# EAGLE design 3comando (EAGLE 6.5.0)
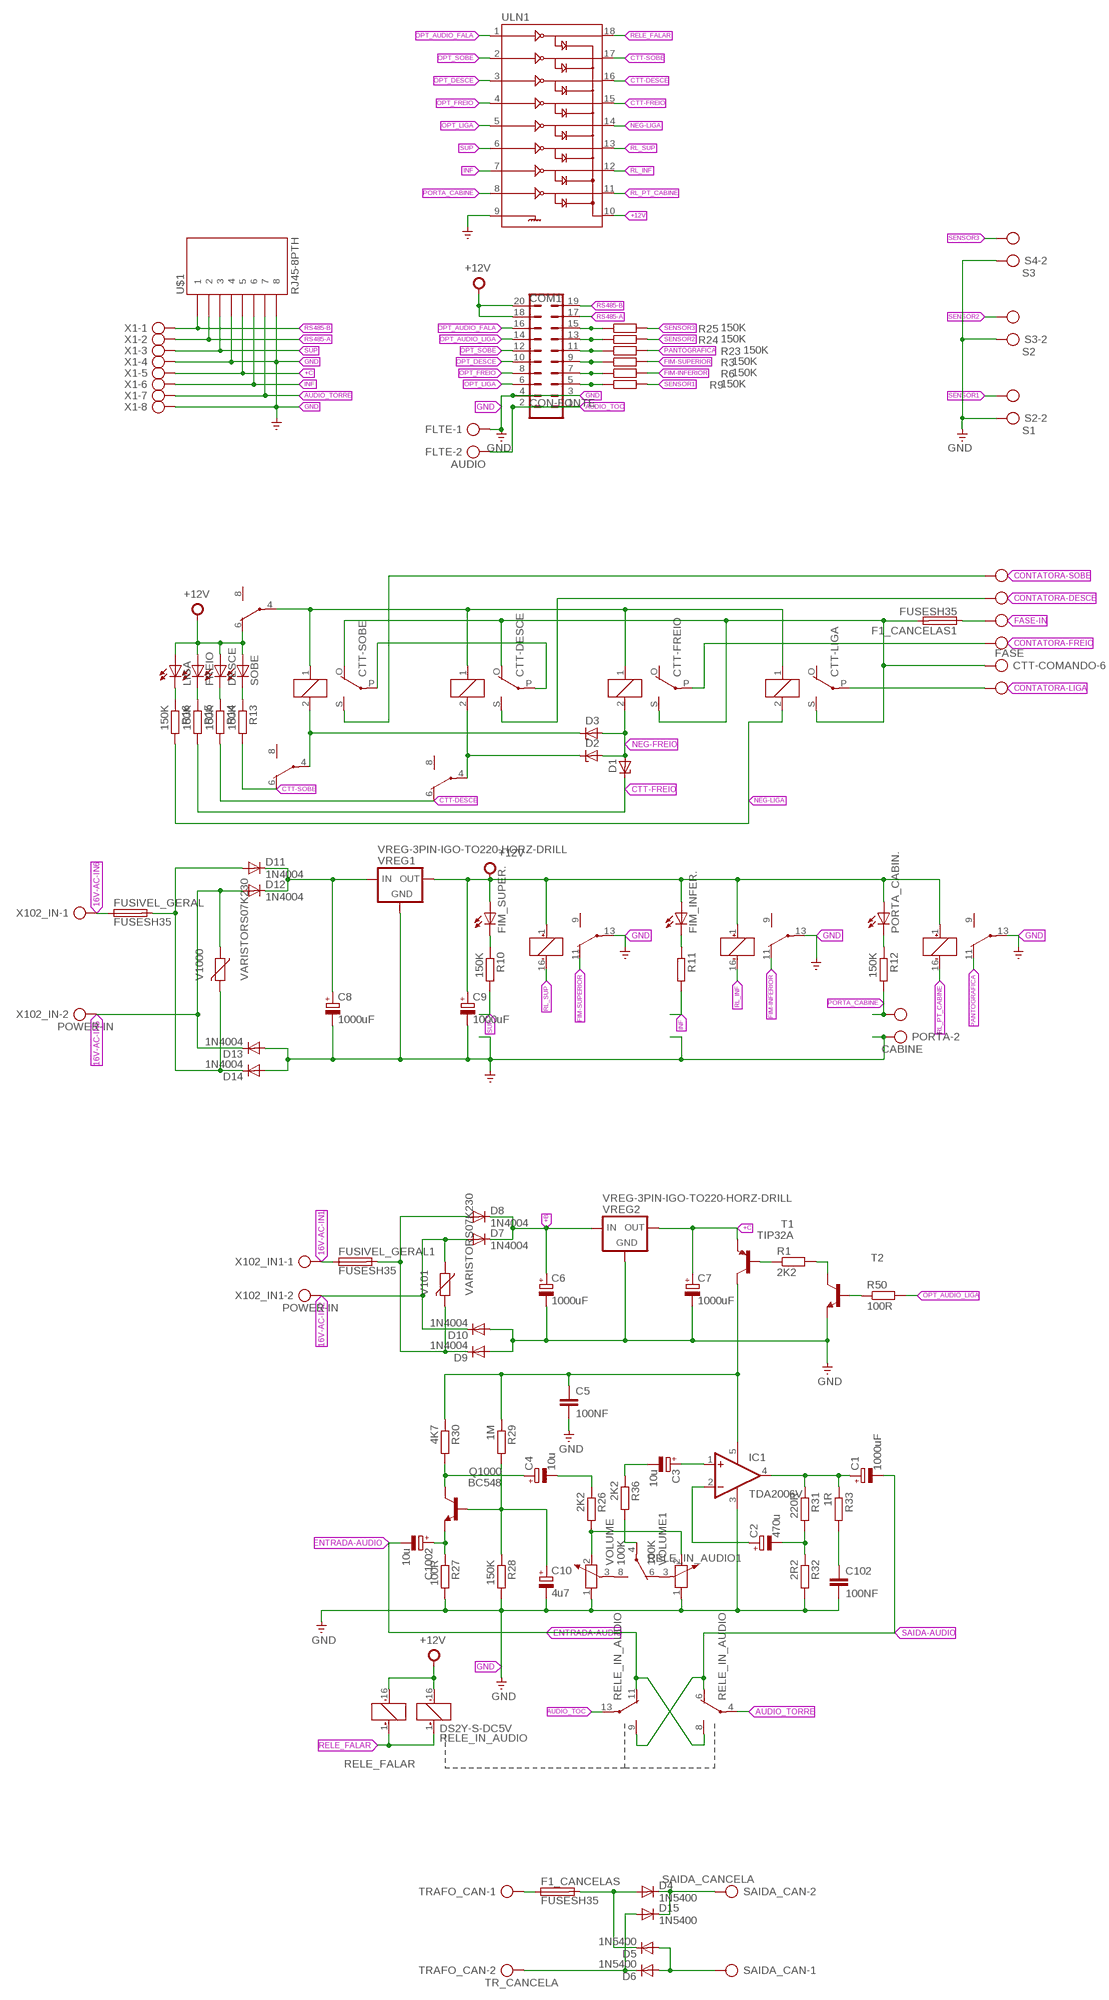
[diagram p0: schematic, sheet 1]

## Parts
C1  1000uF  CPOL-EUTAP5-80  [TAP5-80]
C2  470u  CPOL-EUTAP5-80  [TAP5-80]
C3  10u  CPOL-EUTAP5-45  [TAP5-45]
C4  10u  CPOL-EUTAP5-45  [TAP5-45]
C5  100NF  C-EU050-030X075  [C050-030X075]
C6  1000uF  CPOL-EUTAP5-80  [TAP5-80]
C7  1000uF  CPOL-EUTAP5-80  [TAP5-80]
C8  1000uF  CPOL-EUTAP5-80  [TAP5-80]
C9  1000uF  CPOL-EUTAP5-80  [TAP5-80]
C10  4u7  CPOL-EUTAP5-45  [TAP5-45]
C102  100NF  C-EU050-030X075  [C050-030X075]
C1002  10u  CPOL-EUTAP5-45  [TAP5-45]
COM1  CON-FONTE  ML20  [ML20]
CTT-COMANDO  FASE  AK500/6  [AK500/6]
CTT-DESCE  G5L  [G5LE]
CTT-FREIO  G5L  [G5LE]
CTT-LIGA  G5L  [G5LE]
CTT-SOBE  G5L  [G5LE]
D1  ZENER-DIODEZD-7.5  [ZDIO-7.5]
D2  ZENER-DIODEZD-7.5  [ZDIO-7.5]
D3  ZENER-DIODEZD-7.5  [ZDIO-7.5]
D4  1N5400  [DO201-15]
D5  1N5400  [DO201-15]
D6  1N5400  [DO201-15]
D7  1N4004  [DO41-10]
D8  1N4004  [DO41-10]
D9  1N4004  [DO41-10]
D10  1N4004  [DO41-10]
D11  1N4004  [DO41-10]
D12  1N4004  [DO41-10]
D13  1N4004  [DO41-10]
D14  1N4004  [DO41-10]
D15  1N5400  [DO201-15]
DESCE  LED5MM  [LED5MM]
F1_CANCELAS  FUSESH35  [SH25]
F1_CANCELAS1  FUSESH35  [SH25]
FIM_INFER.  LED5MM  [LED5MM]
FIM_SUPER.  LED5MM  [LED5MM]
FLTE  AUDIO  AK500/2  [AK500/2]
FREIO  LED5MM  [LED5MM]
FUSIVEL_GERAL  FUSESH35  [SH25]
FUSIVEL_GERAL1  FUSESH35  [SH25]
IC1  TDA2006V  [CB360]
LIGA  LED5MM  [LED5MM]
PORTA  CABINE  AK500/2  [AK500/2]
PORTA_CABIN.  LED5MM  [LED5MM]
PORTA_CABINE  DS2Y-S-DC5V  [DS2Y]
Q1000  BC548  [TO92-EBC]
R1  2K2  R-EU_0207/10  [0207/10]
R3  150K  R-EU_0207/10  [0207/10]
R6  150K  R-EU_0207/10  [0207/10]
R9  150K  R-EU_0207/10  [0207/10]
R10  150K  R-EU_0207/10  [0207/10]
R11  150K  R-EU_0207/10  [0207/10]
R12  150K  R-EU_0207/10  [0207/10]
R13  150K  R-EU_0207/10  [0207/10]
R14  150K  R-EU_0207/10  [0207/10]
R15  150K  R-EU_0207/10  [0207/10]
R16  150K  R-EU_0207/10  [0207/10]
R23  150K  R-EU_0207/10  [0207/10]
R24  150K  R-EU_0207/10  [0207/10]
R25  150K  R-EU_0207/10  [0207/10]
R26  2K2  R-EU_0207/10  [0207/10]
R27  100R  R-EU_0207/10  [0207/10]
R28  150K  R-EU_0207/10  [0207/10]
R29  1M  R-EU_0207/10  [0207/10]
R30  4K7  R-EU_0207/10  [0207/10]
R31  220R  R-EU_0207/10  [0207/10]
R32  2R2  R-EU_0207/10  [0207/10]
R33  1R  R-EU_0207/10  [0207/10]
R36  2K2  R-EU_0207/10  [0207/10]
R50  100R  R-EU_0207/10  [0207/10]
RELE_IN_AUDIO  DS2Y-S-DC5V  [DS2Y]
RELE_IN_AUDIO1  DS2Y-S-DC5V  [DS2Y]
RL_FIM_INFERIOR  DS2Y-S-DC5V  [DS2Y]
RL_FIM_SUPERIOR  DS2Y-S-DC5V  [DS2Y]
S2  S1  AK500/2  [AK500/2]
S3  S2  AK500/2  [AK500/2]
S4  S3  AK500/2  [AK500/2]
SAIDA_CAN  SAIDA_CANCELA  AK500/2  [AK500/2]
SOBE  LED5MM  [LED5MM]
T1  TIP32A  [TO220]
T2  BC548-NPN-TO92-CBE  [TO92-CBE]
TRAFO_CAN  TR_CANCELA  AK500/2  [AK500/2]
U$1  RJ45-8PTH  [RJ45-8]
ULN1  ULN2803DIP  [DIL18]
V101  VARISTORS07K230  [S07K230]
V1000  VARISTORS07K230  [S07K230]
VOLUME  100K  POTENTIOMETER_PT-10  [PT-10]
VOLUME1  100K  POTENTIOMETER_PT-10  [PT-10]
VREG1  VREG-3PIN-IGO-TO220-HORZ-DRILL  [TO220-HORZ-DRILL]
VREG2  VREG-3PIN-IGO-TO220-HORZ-DRILL  [TO220-HORZ-DRILL]
X1  RS485_CNT  AK500/8  [AK500/8]
X102_IN  POWER-IN  AK500/2  [AK500/2]
X102_IN1  POWER-IN  AK500/2  [AK500/2]

## Nets
16V-AC-IN1 [power]: FUSIVEL_GERAL1.1 X102_IN1.1
16V-AC-IN2 [power]: D7.A D10.C V101.1 X102_IN1.2
16V-AC-IN5 [power]: D12.A D13.C V1000.1 X102_IN.2
16V-AC-IN6 [power]: FUSIVEL_GERAL.1 X102_IN.1
+12V [power]: C9.+ COM1.18 COM1.20 DESCE.A FIM_INFER..A FIM_SUPER..A FREIO.A LIGA.A PORTA_CABIN..A PORTA_CABINE.1(1:+) PORTA_CABINE.6(2:O) RELE_IN_AUDIO1.16(1:-) RELE_IN_AUDIO.16(1:-) RL_FIM_INFERIOR.1(1:+) RL_FIM_SUPERIOR.1(1:+) SOBE.A ULN1.10 VREG1.3(OUT)
+B [power]: C6.+ D7.C D8.C VREG2.1(IN)
+C [power]: C7.+ T1.3(E) U$1.5 VREG2.3(OUT) X1.5
AC-ALIM [AC]: CTT-COMANDO.6 CTT-DESCE.O(2:O) CTT-FREIO.S(2:S) CTT-LIGA.S(2:S) CTT-SOBE.O(2:O) F1_CANCELAS1.2
AUDIO_TOC [power]: COM1.1 COM1.2 FLTE.2 RELE_IN_AUDIO.13(3:P)
AUDIO_TORRE [power]: RELE_IN_AUDIO.4(2:P) U$1.7 X1.7
CONTATORA-DESCE [AC]: CTT-COMANDO.4 CTT-DESCE.S(2:S)
CONTATORA-FREIO [AC]: CTT-COMANDO.3 CTT-FREIO.P(2:P)
CONTATORA-LIGA [AC]: CTT-COMANDO.2 CTT-LIGA.P(2:P)
CONTATORA-SOBE [AC]: CTT-COMANDO.5 CTT-SOBE.S(2:S)
CTT-DESCE: R14.2 RL_FIM_INFERIOR.6(2:O) ULN1.16
CTT-FREIO: D1.C R15.2 ULN1.15
CTT-SOBE: R13.2 RL_FIM_SUPERIOR.6(2:O) ULN1.17
ENTRADA-AUDIO: C1002.- RELE_IN_AUDIO.8(2:S) RELE_IN_AUDIO.11(3:O)
FASE-IN [AC]: CTT-COMANDO.1 F1_CANCELAS1.1
FIM-INFERIOR: R6.2 RL_FIM_INFERIOR.11(3:O)
FIM-SUPERIOR: R3.2 RL_FIM_SUPERIOR.11(3:O)
GND [power]: C5.2 C6.- C7.- C8.- C9.- C10.- C102.2 COM1.3 COM1.4 D9.A D10.A D13.A D14.A FLTE.1 IC1.3(V-) PORTA.2 PORTA_CABINE.13(3:P) R27.2 R28.2 R32.2 RL_FIM_INFERIOR.13(3:P) RL_FIM_SUPERIOR.13(3:P) S2.2 S3.2 S4.2 T2.E U$1.4 U$1.8 ULN1.9 VOLUME1.1 VOLUME.1 VREG1.2(GND) VREG2.2(GND) X1.4 X1.8
INF: R11.2 U$1.6 ULN1.7 X1.6
N$1 [AC]: D4.C D15.C SAIDA_CAN.2
N$2 [AC]: D4.A D5.C F1_CANCELAS.2
N$3 [AC]: D6.C D15.A TRAFO_CAN.2
N$4 [AC]: D5.A D6.A SAIDA_CAN.1
N$5 [power]: CTT-DESCE.1 CTT-FREIO.1 CTT-LIGA.1 CTT-SOBE.1 PORTA_CABINE.4(2:P)
N$6: RELE_IN_AUDIO1.8(2:S) VOLUME.3
N$7 [power]: C8.+ D11.C D12.C VREG1.1(IN)
N$10: FIM_SUPER..K(C) R10.1
N$11: R26.2 VOLUME1.2 VOLUME.2
N$19: FIM_INFER..K(C) R11.1
N$21: R1.1 T1.1(B)
N$24: PORTA_CABIN..K(C) R12.1
N$28: R13.1 SOBE.K(C)
N$29: DESCE.K(C) R14.1
N$32: FREIO.K(C) R15.1
N$33: LIGA.K(C) R16.1
N$39: R50.1 T2.B
N$43: RELE_IN_AUDIO1.6(2:O) VOLUME1.3
N$44: R36.2 RELE_IN_AUDIO1.4(2:P)
N$78 [AC]: F1_CANCELAS.1 TRAFO_CAN.1
N$79 [power]: C1.+ IC1.4(OUT) R31.1 R33.1
N$80: C4.- R26.1
N$89: C4.+ Q1000.C R30.2
N$90: C10.+ Q1000.B R28.1 R29.2
N$92: C1002.+ Q1000.E R27.1
N$94: C3.- R36.1
N$104 [power]: C5.1 IC1.5(V+) R29.1 R30.1 T1.2(C)
N$105: C3.+ IC1.1(+IN)
N$106 [power]: C2.- R31.2 R32.1
N$119 [power]: C2.+ IC1.2(-IN)
N$120: C102.1 R33.2
NEG-DESCE: CTT-DESCE.2 D2.C RL_FIM_INFERIOR.4(2:P)
NEG-FREIO: CTT-FREIO.2 D1.A D2.A D3.A
NEG-LIGA: CTT-LIGA.2 R16.2 ULN1.14
NEG-SOB: CTT-SOBE.2 D3.C RL_FIM_SUPERIOR.4(2:P)
OPT_AUDIO_FALA: COM1.16 ULN1.1
OPT_AUDIO_LIGA: COM1.14 R50.2
OPT_DESCE: COM1.10 ULN1.3
OPT_FIM_INFERIOR: COM1.7 R6.1
OPT_FIM_SUPERIOR: COM1.9 R3.1
OPT_FREIO: COM1.8 ULN1.4
OPT_LIGA: COM1.6 ULN1.5
OPT_PANTOGRAFICA: COM1.11 R23.1
OPT_SENSOR1: COM1.5 R9.1
OPT_SENSOR2: COM1.13 R24.1
OPT_SENSOR3: COM1.15 R25.1
OPT_SOBE: COM1.12 ULN1.2
PANTOGRAFICA: PORTA_CABINE.11(3:O) R23.2
PORTA_CABINE: PORTA.1 R12.2 ULN1.8
RELE_FALAR: RELE_IN_AUDIO1.1(1:+) RELE_IN_AUDIO.1(1:+) ULN1.18
RELE_LIGA_AUDIO: R1.2 T2.C
RL_INF: RL_FIM_INFERIOR.16(1:-) ULN1.12
RL_PT_CABINE: PORTA_CABINE.16(1:-) ULN1.11
RL_SUP: RL_FIM_SUPERIOR.16(1:-) ULN1.13
RS485-A: COM1.17 U$1.2 X1.2
RS485-B: COM1.19 U$1.1 X1.1
SAIDA-AUDIO [power]: C1.- RELE_IN_AUDIO.6(2:O) RELE_IN_AUDIO.9(3:S)
SAIDA_FUSIVEL [power]: D11.A D14.C FUSIVEL_GERAL.2 V1000.2
SAIDA_FUSIVEL1 [power]: D8.A D9.C FUSIVEL_GERAL1.2 V101.2
SENSOR1: R9.2 S2.1
SENSOR2: R24.2 S3.1
SENSOR3: R25.2 S4.1
SOB-DESC-PROT [AC]: CTT-DESCE.P(2:P) CTT-SOBE.P(2:P)
SUP: R10.2 U$1.3 ULN1.6 X1.3
Unconnected: CTT-FREIO.O(2:O) CTT-LIGA.O(2:O) PORTA_CABINE.8(2:S) PORTA_CABINE.9(3:S) RELE_IN_AUDIO1.9(3:S) RELE_IN_AUDIO1.11(3:O) RELE_IN_AUDIO1.13(3:P) RL_FIM_INFERIOR.8(2:S) RL_FIM_INFERIOR.9(3:S) RL_FIM_SUPERIOR.8(2:S) RL_FIM_SUPERIOR.9(3:S)

## Library data of the parts
C1-C4 C6-C10 C1002 = rcl:CPOL-EU: POLARIZED CAPACITOR, European symbol
C5 C102 = rcl:C-EU: CAPACITOR, European symbol
COM1 = con-ml:ML20: HARTING; OC_FARNELL: unknown; OC_NEWARK: unknown
CTT-COMANDO = con-ptr500:AK500/6: CONNECTOR; OC_FARNELL: unknown; OC_NEWARK: unknown
CTT-DESCE CTT-FREIO CTT-LIGA CTT-SOBE = relay:G5L: RELAY 1 x switch, 10 A/120 V AC, 8 A/30 V ADC, Omron; OC_FARNELL: unknown; OC_NEWARK: unknown
D1-D3 = diode:ZENER-DIODE: Z-Diode
D4-D6 D15 = diode:1N5400: DIODE standard rectifier, 3 A, 50 V (Motorola)
D7-D14 = diode:1N4004: DIODE general purpose rectifier, 1 A
DESCE FIM_INFER. FIM_SUPER. FREIO LIGA PORTA_CABIN. SOBE = led:LED: LED OSRAM: - CHIPLED LG R971, LG N971, LY N971, LG Q971, LY Q971, LO R971, LY R971 LH N974, LH R974 LS Q976, LO Q976, LY Q976 LO Q996 - Hyper CHIPLED LW Q18S LB Q993, LB Q99A, LB R99A - SideLED LS A670, LO A670, LY A670, LG A670, LP A670 LB A673, LV A673, LT A673, LW A673 LH A674 LY A675 LS A676, LA A676, LO A676, LY A676, LW A676 LS A679, LY A679, LG A679 - Hyper Micro SIDELED® LS Y876, LA Y876, LO Y876, LY Y876 LT Y87S - SmartLED LW L88C, LW L88S LB L89C, LB L89S, LG L890 LS L89K, LO L89K, LY L89K LS L896, LA L896, LO L896, LY L896 - TOPLED LS T670, LO T670, LY T670, LG T670, LP T670 LSG T670, LSP T670, LSY T670, LOP T670, LYG T670 LG T671, LOG T671, LSG T671 LB T673, LV T673, LT T673, LW T673 LH T674 LS T676, LA T676, LO T676, LY T676, LB T676, LH T676, LSB T676, LW T676 LB T67C, LV T67C, LT T67C, LS T67K, LO T67K, LY T67K, LW E67C LS E67B, LA E67B, LO E67B, LY E67B, LB E67C, LV E67C, LT E67C LW T67C LS T679, LY T679, LG T679 LS T770, LO T770, LY T770, LG T770, LP T770 LB T773, LV T773, LT T773, LW T773 LH T774 LS E675, LA E675, LY E675, LS T675 LS T776, LA T776, LO T776, LY T776, LB T776 LHGB T686 LT T68C, LB T68C - Hyper Mini TOPLED® LB M676 - Mini TOPLED Santana® LG M470 LS M47K, LO M47K, LY M47K Source: http://www.osram.convergy.de LUXEON: - LUMILED® LXK2-PW12-R00, LXK2-PW12-S00, LXK2-PW14-U00, LXK2-PW14-V00 LXK2-PM12-R00, LXK2-PM12-S00, LXK2-PM14-U00 LXK2-PE12-Q00, LXK2-PE12-R00, LXK2-PE12-S00, LXK2-PE14-T00, LXK2-PE14-U00 LXK2-PB12-K00, LXK2-PB12-L00, LXK2-PB12-M00, LXK2-PB14-N00, LXK2-PB14-P00, LXK2-PB14-Q00 LXK2-PR12-L00, LXK2-PR12-M00, LXK2-PR14-Q00, LXK2-PR14-R00 LXK2-PD12-Q00, LXK2-PD12-R00, LXK2-PD12-S00 LXK2-PH12-R00, LXK2-PH12-S00 LXK2-PL12-P00, LXK2-PL12-Q00, LXK2-PL12-R00 Source: www.luxeon.com KINGBRIGHT: KA-3528ASYC Source: www.kingbright.com
F1_CANCELAS F1_CANCELAS1 FUSIVEL_GERAL FUSIVEL_GERAL1 = fuse:FUSE: Fuse; OC_FARNELL: unknown; OC_NEWARK: unknown
FLTE PORTA S2-S4 SAIDA_CAN TRAFO_CAN X102_IN X102_IN1 = con-ptr500:AK500/2: CONNECTOR; OC_FARNELL: unknown; OC_NEWARK: unknown
IC1 = linear:TDA2006: AUDIO AMPLIFIER
PORTA_CABINE RELE_IN_AUDIO RELE_IN_AUDIO1 RL_FIM_INFERIOR RL_FIM_SUPERIOR = relay:DS2Y-S-DC*: MINIATURE RELAY NAiS Source: http://www.mew-europe.com/.. en_ds_61005_0023.pdf; MPN: DS2Y-S-DC5V; OC_FARNELL: unknown; OC_NEWARK: 13P3268
Q1000 = transistor-npn:BC548*: NPN Transistor
R1 R3 R6 R9-R16 R23-R33 R36 R50 = rcl:R-EU_: RESISTOR, European symbol
T1 = transistor:TIP32: PNP Transistor Medium Power Linear Switching Applications Source: http://onsemi.com
T2 = transistor:*-NPN-: NPN Transistror BF959 corrected 2008.03.06
U$1 = SparkFun-Connectors:RJ45-8: RJ45 Jack Simple RJ45, 8-pin connection - connector for common Cat5, Cat5e, and Cat6 Ethernet cables. Footprint not yet proven in production. Connector sku is PRT-00643; Breakout PCB sku is BOB-00716.
ULN1 = SparkFun:ULN2803: Darlington Driver ULN2803 Darlington array. 500mA max per channel, 8-channel package. Spark Fun Electronics SKU : COM-00312
V101 V1000 = varistor:VARISTOR: VARISTOR
VOLUME VOLUME1 = rcl:POTENTIOMETER_: Potentiometer
VREG1 VREG2 = tidyeagle:VREG-3PIN: Generic 3 Pin Voltage Regulator For voltage regulators such as the LM7805 and similar. Horizontal TO220 packages are available with and without drill holes for mounting. Important: Note the pin connection and check against your datasheet. Pin 1 is the left most pin when looking down from the top of the package, as shown in the diagram on the right hand side. IGO (e.g. LM7805) Pin 1 - Input Pin 2 - GND Pin 3 - Output GOI (e.g. LD1086V33) Pin 1 - GND Pin 2 - Output Pin 3 - Input
X1 = con-ptr500:AK500/8: CONNECTOR; OC_FARNELL: unknown; OC_NEWARK: unknown

## Net classes
0 default: drill 0.203 mm, clearance 0.203 mm
1 AC: width 2.032 mm, drill 0.203 mm, clearance 0.203 mm
2 power: width 0.762 mm, drill 0.203 mm, clearance 0.203 mm

## Board
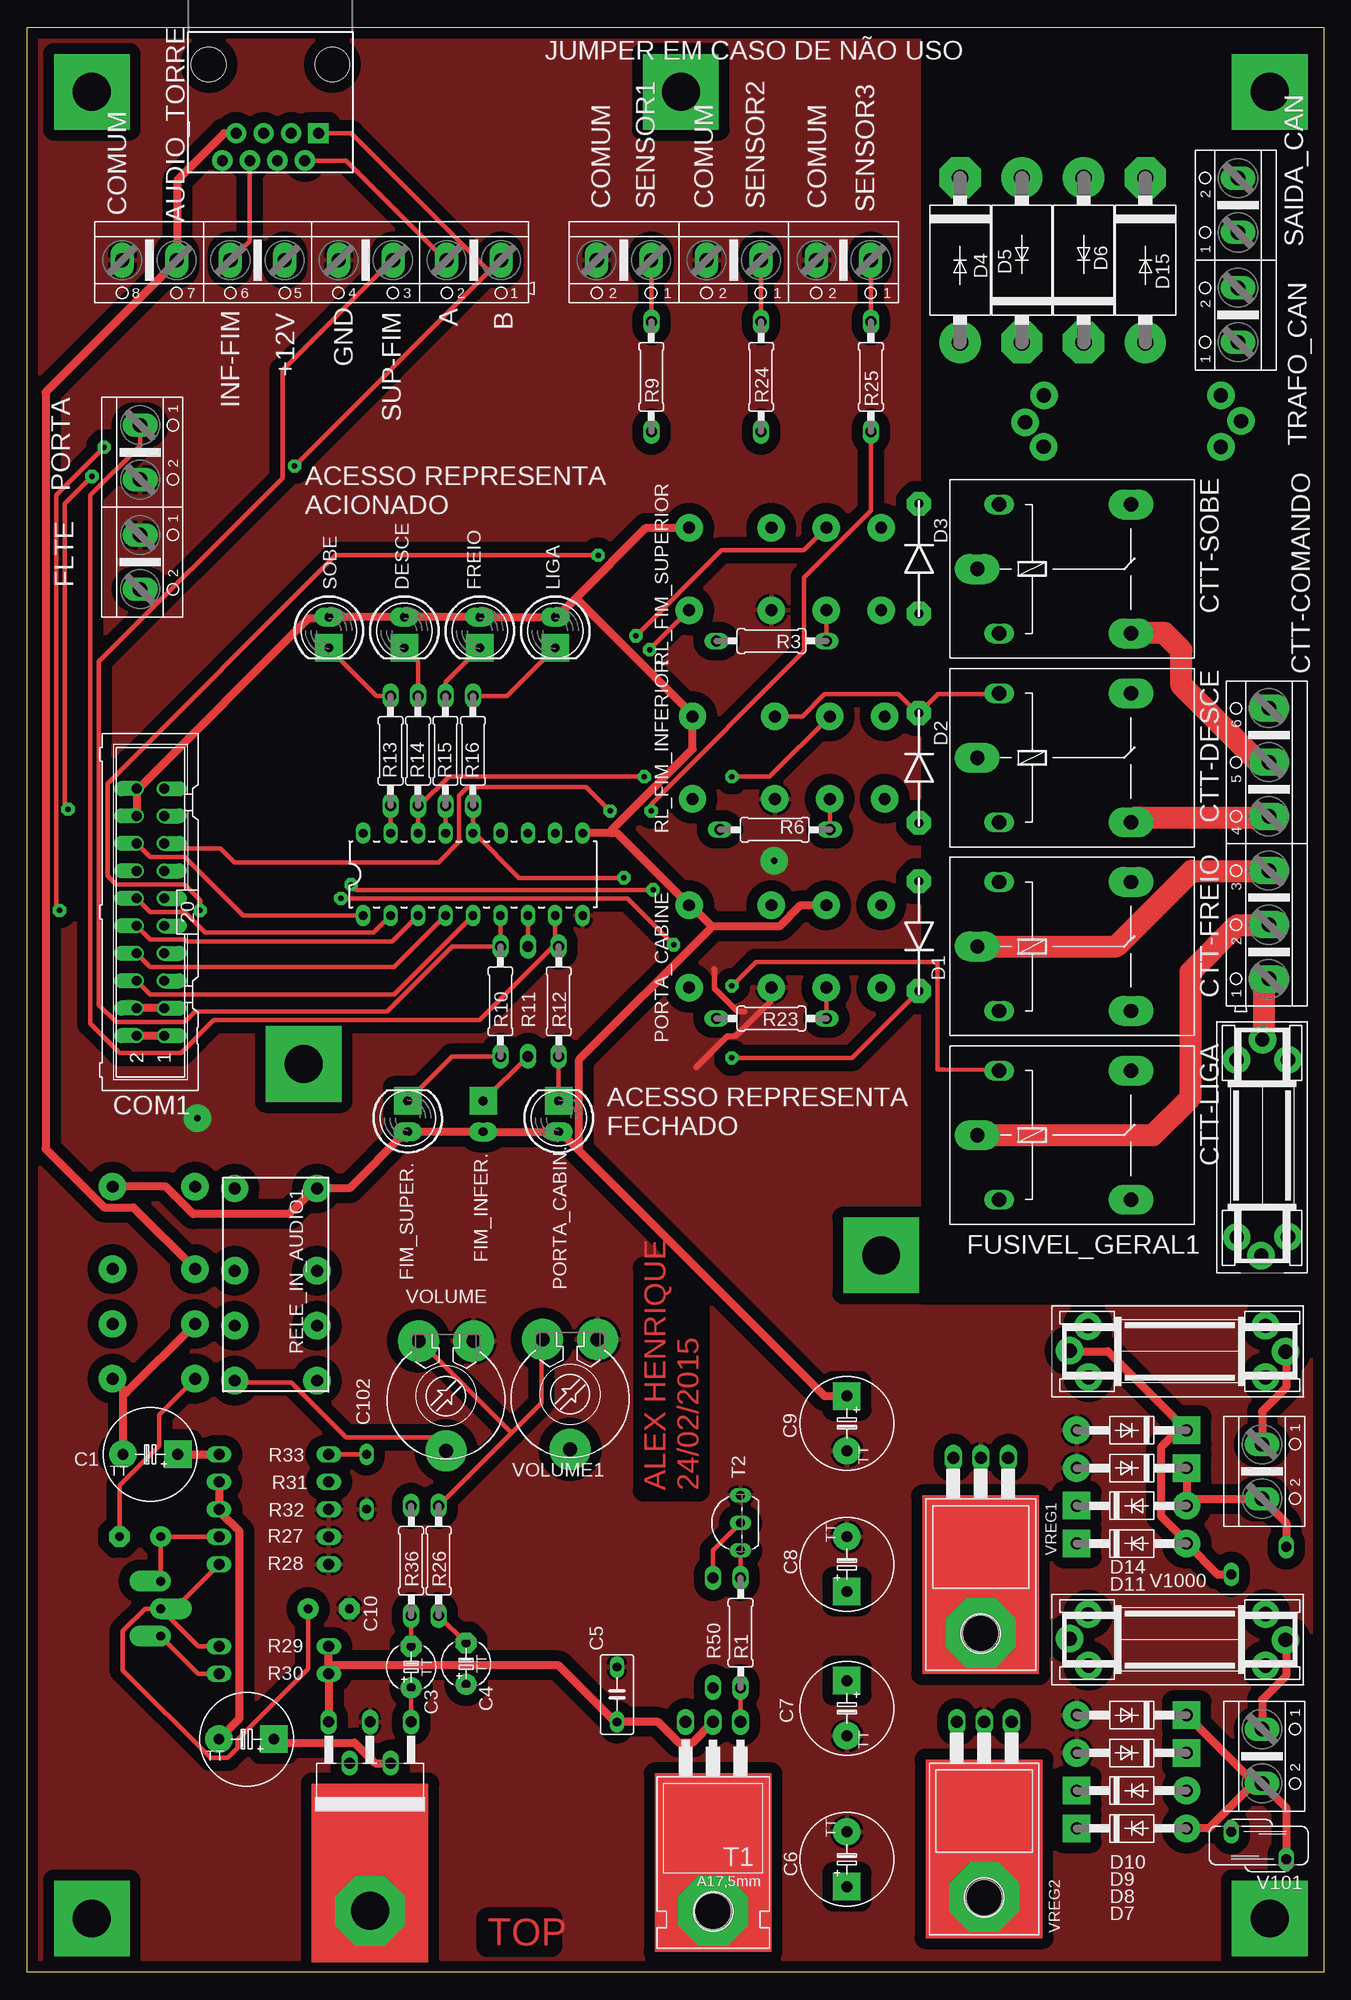
[diagram p1: board, top side]
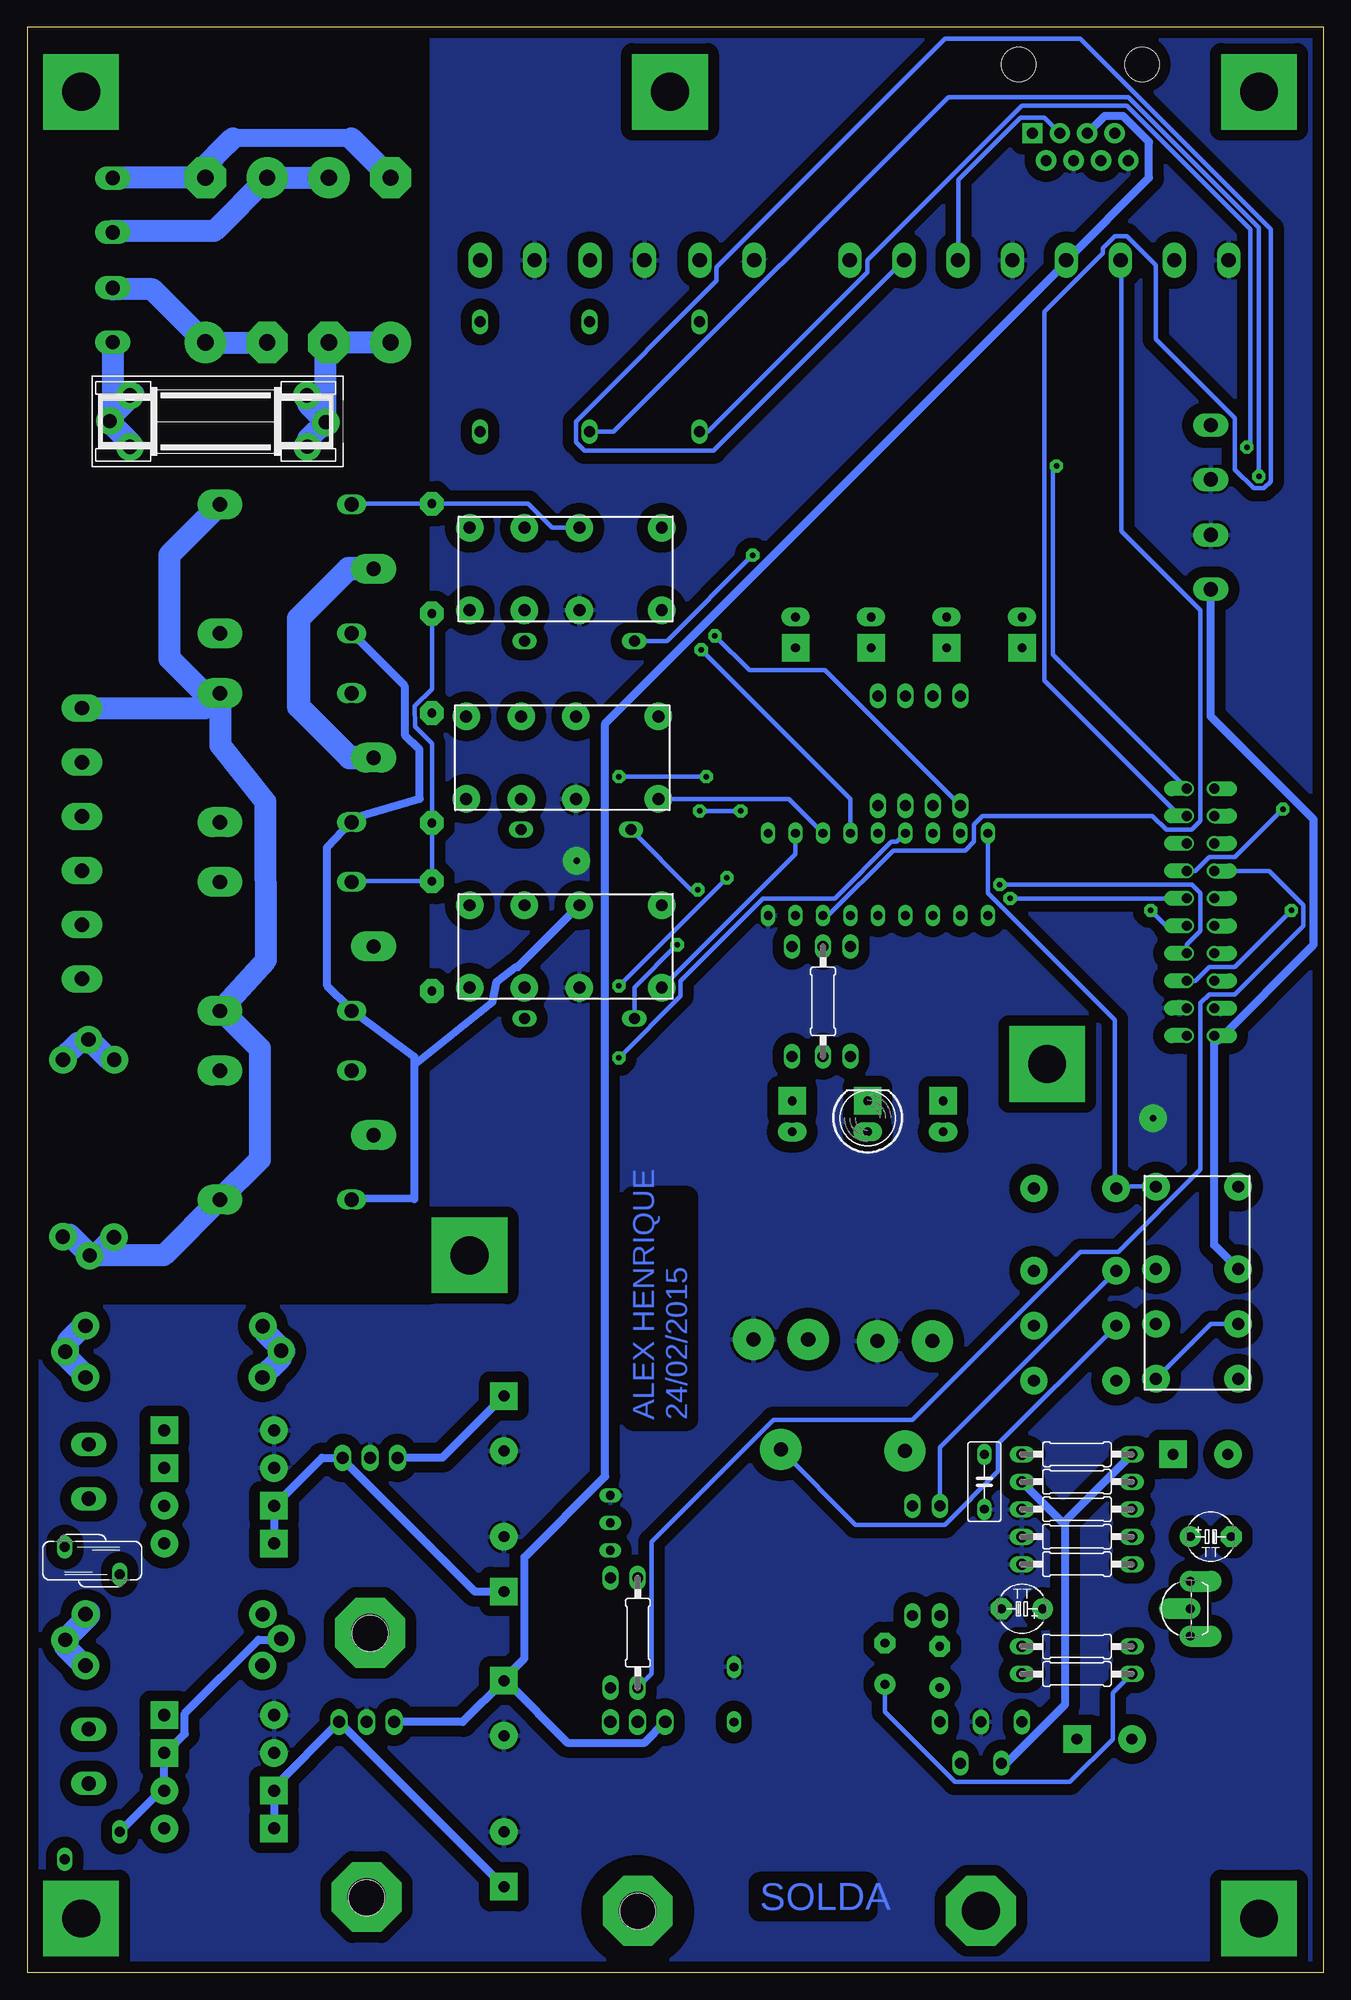
[diagram p2: board, bottom side, seen from below]

Size 120 x 180 mm. Coordinates in mm from the lower left corner, seen from the top.
Outline: 120,0 0,0 0,180 120,180 120,0
Copper layers (1*16): Top 0.035mm / dielectric 1.5mm / Bottom 0.035mm
Design rules "placa35": minimum track width 16mil, minimum drill 20mil, track to track 10mil, track to pad 10mil, pad to pad 10mil, via to via 10mil, smd to smd 10mil, copper to edge 20mil, drill to drill 10mil, minimum pad ring 10mil, minimum via ring 14mil, stop-mask expansion 4mil, vias tented up to drill 0mil, thermal gap 10mil

### Footprints (pad centres in the part's own frame; a part is rotated, then mirrored left to right if it is on the bottom)
TAP5-80 = drill 1 pad 2.54 square: + -2.54,0 | drill 1 pad 2.54: - 2.54,0
TAP5-45 = drill 0.813 pad 1.93: + -1.905,0 | drill 0.813 pad 1.93 octagon: - 1.905,0
C050-030X075 = drill 0.813 pad 1.27 long: 1 -2.54,0; 2 2.54,0
ML20 = drill 0.9 pad 1.016 offset: 1 -11.43,-1.27; 2 -11.43,1.27; 3 -8.89,-1.27; 4 -8.89,1.27; 5 -6.35,-1.27; 6 -6.35,1.27; 7 -3.81,-1.27; 8 -3.81,1.27; 9 -1.27,-1.27; 10 -1.27,1.27; 11 1.27,-1.27; 12 1.27,1.27; 13 3.81,-1.27; 14 3.81,1.27; 15 6.35,-1.27; 16 6.35,1.27; 17 8.89,-1.27; 18 8.89,1.27; 19 11.43,-1.27; 20 11.43,1.27
AK500/6 = drill 1.321 pad 2.54 long: 1 -12.522,0; 2 -7.518,0; 3 -2.515,0; 4 2.515,0; 5 7.518,0; 6 12.522,0
G5LE = drill 1.321 long: 1 -7.493,-5.969; 2 -7.493,5.969 | drill 1.321 pad 2.794 long: O 4.699,5.969; P -9.525,0; S 4.699,-5.969
ZDIO-7.5 = drill 0.813 pad 2.184 octagon: A 5.08,0; C -5.08,0
DO201-15 = drill 1.499 pad 3.81: A 7.62,0 | drill 1.499 pad 3.81 octagon: C -7.62,0
DO41-10 = drill 1.118 pad 2.54: A 5.08,0 | drill 1.118 pad 2.54 square: C -5.08,0
LED5MM = drill 0.813 pad 1.778 long: A -1.27,0 | drill 0.813 pad 2.54 square: K 1.587,0
SH25 = drill 1.321 pad 2.54: 1 -9.802,0.028; 2 10.18,-0.077; 4 -7.938,2.4; 5 -7.938,-2.362; 6 8.435,2.402; 7 8.475,-2.34
AK500/2 = drill 1.321 pad 2.184 long: 1 -2.515,0; 2 2.515,0
CB360 = drill 1.016 long: 1 -3.81,-8.255; 2 -1.905,-4.445; 3 0,-8.255; 4 1.905,-4.445; 5 3.81,-8.255
DS2Y = drill 1.1 pad 2.54: 1 -8.89,-3.81; 4 -1.27,-3.81; 6 3.81,-3.81; 8 8.89,-3.81; 9 8.89,3.81; 11 3.81,3.81; 13 -1.27,3.81; 16 -8.89,3.81
TO92-EBC = drill 0.813 pad 1.93 offset: B 0,-1.27; C -2.54,-1.27; E 2.54,-1.27
0207/10 = drill 1.016 pad 1.422 long: 1 -5.08,0; 2 5.08,0
TO220 = drill 1.118 long: 1 -2.54,-6.35; 2 0,-6.35; 3 2.54,-6.35 | hole 3.302: 0,11.176
TO92-CBE = drill 0.813 long: B 0,0; C -2.54,0; E 2.54,0
RJ45-8 = drill 1 pad 1.88 square: 1 -4.445,6.35 | drill 1 pad 1.88: 2 -3.175,8.89; 3 -1.905,6.35; 4 -0.635,8.89; 5 0.635,6.35; 6 1.905,8.89; 7 3.175,6.35; 8 4.445,8.89 | hole 3.2: -5.715,0; 5.715,0
DIL18 = drill 0.813 long: 1 -10.16,-3.81; 2 -7.62,-3.81; 3 -5.08,-3.81; 4 -2.54,-3.81; 5 0,-3.81; 6 2.54,-3.81; 7 5.08,-3.81; 8 7.62,-3.81; 9 10.16,-3.81; 10 10.16,3.81; 11 7.62,3.81; 12 5.08,3.81; 13 2.54,3.81; 14 0,3.81; 15 -2.54,3.81; 16 -5.08,3.81; 17 -7.62,3.81; 18 -10.16,3.81
S07K230 = drill 0.914 long: 1 -1.27,-2.54; 2 1.27,2.54
PT-10 = drill 1.3 pad 3.81: 1 -2.54,-5.08; 2 2.54,-5.08; 3 0,5.08
TO220-HORZ-DRILL = drill 1.118 long: 1 -2.54,-8.89; 2 0,-8.89; 3 2.54,-8.89 | hole 3.302: 0,7.366
AK500/8 = drill 1.321 pad 2.184 long: 1 -17.526,0; 2 -12.497,0; 3 -7.518,0; 4 -2.489,0; 5 2.489,0; 6 7.518,0; 7 12.497,0; 8 17.526,0

### Placement (x,y rotation side)
C1  11.42,47.94 180 top
C2  20.3,21.59 180 top
C3  35.54,28.26 90 top
C4  40.62,28.58 90 top
C5  54.59,25.72 90 top
C6  75.87,10.48 90 top
C7  75.87,24.45 270 top
C8  75.87,37.78 90 top
C9  75.87,50.8 270 top
C10  27.93,33.66 180 bottom
C102  31.42,45.4 270 bottom
C1002  10.46,40.32 0 bottom
COM1  11.42,98.11 90 top
CTT-COMANDO  114.92,104.46 90 top
CTT-DESCE  97.46,112.4 0 top
CTT-FREIO  97.46,94.93 0 top
CTT-LIGA  97.46,77.47 0 top
CTT-SOBE  97.46,129.86 0 top
D1  82.54,95.89 90 top
D2  82.54,111.44 270 top
D3  82.54,130.81 270 top
D4  86.34,158.43 270 top
D5  92.06,158.43 90 top
D6  97.78,158.43 90 top
D7  102.22,13.33 0 top
D8  102.22,16.83 0 top
D9  102.22,20.32 180 top
D10  102.22,23.81 180 top
D11  102.22,39.69 0 top
D12  102.22,43.18 0 top
D13  102.22,46.67 180 top
D14  102.22,50.16 180 top
D15  103.49,158.43 270 top
DESCE  34.91,124.14 270 top
F1_CANCELAS  102.54,143.51 0 bottom
F1_CANCELAS1  114.29,76.52 270 top
FIM_INFER.  42.21,79.06 90 bottom
FIM_SUPER.  35.23,79.06 90 top
FLTE  10.46,130.49 270 top
FREIO  41.89,124.14 270 top
FUSIVEL_GERAL  106.67,57.47 180 top
FUSIVEL_GERAL1  106.67,30.8 180 top
IC1  31.73,14.92 180 top
LIGA  48.88,124.14 270 top
PORTA  10.46,140.65 270 top
PORTA_CABIN.  49.2,79.06 90 top
PORTA_CABINE  70.15,94.93 180 bottom
Q1000  13.64,33.66 90 bottom
R1  66.03,31.43 90 top
R3  68.88,123.19 0 top
R6  69.2,105.73 0 top
R9  57.77,147.64 90 top
R10  43.8,89.85 90 top
R11  46.34,89.85 90 bottom
R12  49.2,89.85 90 top
R13  33.64,113.03 270 top
R14  36.18,113.03 270 top
R15  38.72,113.03 270 top
R16  41.26,113.03 270 top
R23  68.88,88.27 0 top
R24  67.93,147.64 90 top
R25  78.09,147.64 90 top
R26  38.08,38.1 90 top
R27  22.84,40.32 180 bottom
R28  22.84,37.78 180 bottom
R29  22.84,30.16 0 bottom
R30  22.84,27.62 0 bottom
R31  22.84,45.4 0 bottom
R32  22.84,42.86 180 bottom
R33  22.84,47.94 180 bottom
R36  35.54,38.1 90 top
R50  63.48,31.43 270 bottom
RELE_IN_AUDIO  11.73,63.82 270 bottom
RELE_IN_AUDIO1  23.02,63.65 270 top
RL_FIM_INFERIOR  70.47,112.4 180 bottom
RL_FIM_SUPERIOR  70.15,129.86 180 bottom
S2  55.23,158.43 180 top
S3  65.39,158.43 180 top
S4  75.55,158.43 180 top
SAIDA_CAN  112.06,163.51 90 top
SOBE  27.93,124.14 270 top
T1  63.48,16.83 180 top
T2  66.03,41.59 90 top
TRAFO_CAN  112.06,153.35 90 top
U$1  22.53,176.53 180 top
ULN1  41.26,101.6 0 top
V101  113.97,11.75 90 top
V1000  113.97,38.1 270 bottom
VOLUME  38.77,53.34 180 top
VOLUME1  50.25,53.49 180 top
VREG1  88.25,38.73 180 top
VREG2  88.57,14.29 180 top
X1  26.34,158.43 180 top
X102_IN  114.29,46.35 270 top
X102_IN1  114.29,20 270 top

### Tracks (layer width: path | path; a pad name or v marks a point on that pad's centre or on a via)
16V-AC-IN1
  Top 0.762: X102_IN1.1 114.29,25.24 116.51,27.46 116.51,30.64 FUSIVEL_GERAL1.1
16V-AC-IN2
  Top 0.762: V101.1 116.51,15.24 114.29,17.46 X102_IN1.2 | D7.A 109.36,13.34 113.33,17.3 113.97,17.3 X102_IN1.2 | D10.C 113.49,17.62 X102_IN1.2
16V-AC-IN5
  Top 0.762: V1000.1 116.51,41.59 114.29,43.82 X102_IN.2 113.97,43.82 107.62,43.82 D12.A D13.C
16V-AC-IN6
  Top 0.762: X102_IN.1 114.29,51.91 116.51,54.13 116.51,57.31 FUSIVEL_GERAL.1
+12V
  Top 0.762: 54.12,105.41 54.6,105.41 PORTA_CABINE.1 61.58,98.58 63.33,96.84 | 54.12,105.41 ULN1.10 | PORTA_CABINE.6 71.58,98.74 69.68,96.84 63.33,96.84 | 54.12,105.41 54.12,105.73 61.58,113.19 RL_FIM_INFERIOR.1 61.42,116.52 50.79,127.16 | COM1.18 COM1.20 10.46,109.7 26.02,125.25 27.61,125.25 SOBE.A DESCE.A FREIO.A LIGA.A 49.2,125.57 50.79,127.16 | RL_FIM_SUPERIOR.1 57.29,133.67 50.79,127.16 | RELE_IN_AUDIO.16 12.84,72.71 15.38,70.17 24.27,70.17 26.5,72.39 RELE_IN_AUDIO1.16 26.97,72.55 29.83,72.55 34.91,77.63 FIM_SUPER..A FIM_INFER..A PORTA_CABIN..A 49.52,77.63 50.86,76.28 | C9.+ 73.8,53.34 50.86,76.28 | 63.33,96.84 63.17,96.52 51.1,84.46 51.1,76.52 50.86,76.28
  Bottom 0.762: VREG1.3 81.58,47.63 C9.+
+B
  Bottom 0.762: D7.C D8.C 97.14,17.15 VREG2.1 C6.+
+C
  Bottom 0.762: U$1.5 20.31,171.77 18.56,171.77 16.18,169.39 16.18,166.05 23.8,158.43 X1.5 23.96,158.12 66.5,115.57 66.5,45.88 73.96,38.42 73.96,29.05 75.71,27.31 C7.+ | VREG2.3 79.68,23.18 C7.+ | T1.3 62.85,21.27 69.99,21.27 75.55,26.83 C7.+
AC-ALIM
  Top 2.032: 114.13,66.2 F1_CANCELAS1.2
  Bottom 2.032: CTT-DESCE.O 102.06,118.27 102.09,113.53 97.94,108.31 97.89,93.69 CTT-FREIO.S 101.93,88.96 98.46,85.5 98.46,75.2 CTT-LIGA.S 102.22,71.5 107.38,66.34 F1_CANCELAS1.2 | CTT-COMANDO.6 103.54,116.98 CTT-DESCE.O | CTT-DESCE.O 103.62,118.36 106.82,121.56 106.82,131.17 CTT-SOBE.O
AUDIO_TOC
  Top 0.762: COM1.2 COM1.1
  Bottom 0.762: RELE_IN_AUDIO.13 10.15,67.31 COM1.2 9.83,86.2 0.94,95.09 0.94,106.68 10.46,116.21 FLTE.2
AUDIO_TORRE
  Top 0.762: U$1.7 18.24,170.18 13.96,165.89 13.96,158.43 X1.7 13.64,158.12 1.73,146.21 1.73,76.2 7.13,70.8 9.83,70.8 RELE_IN_AUDIO.4
CONTATORA-DESCE
  Top 2.032: CTT-COMANDO.4 114.92,106.84 102.54,106.84 102.22,106.52 CTT-DESCE.S
CONTATORA-FREIO
  Top 2.032: CTT-FREIO.P 100.79,94.93 107.78,101.92 114.92,101.92 CTT-COMANDO.3
CONTATORA-LIGA
  Top 2.032: CTT-LIGA.P 104.18,77.47 107.68,80.98 107.68,92.58 112,96.9 114.88,96.9 CTT-COMANDO.2
CONTATORA-SOBE
  Top 2.032: CTT-COMANDO.5 113.94,111.98 106.82,119.1 106.82,122.35 105.24,123.93 102.19,123.93 CTT-SOBE.S
CTT-DESCE  (via drill 0.51)
  Top 0.406: ULN1.16 R14.2 36.34,107.95 39.04,110.65 v57.14,110.65 | v65.23,110.65 68.72,110.65 RL_FIM_INFERIOR.6
  Bottom 0.406: v65.23,110.65 v57.14,110.65
CTT-FREIO  (via drill 0.51)
  Top 0.406: R15.2 ULN1.15 | v65.23,84.61 76.34,84.61 D1.C
  Bottom 0.406: ULN1.15 39.51,104.62 39.99,104.62 45.23,99.38 51.9,99.38 59.52,91.76 59.52,90.33 v65.23,84.61
CTT-SOBE  (via drill 0.51)
  Top 0.406: R13.2 ULN1.17 | v56.34,123.67 64.28,131.6 71.9,131.6 RL_FIM_SUPERIOR.6
  Bottom 0.406: R13.2 46.18,120.49 53.17,120.49 v56.34,123.67
ENTRADA-AUDIO
  Top 0.406: C1002.- 8.56,45.09 12.21,48.74 12.21,51.59 RELE_IN_AUDIO.8
  Bottom 0.406: RELE_IN_AUDIO.11 10.46,60.01 RELE_IN_AUDIO.8
FASE-IN
  Top 2.032: F1_CANCELAS1.1 114.44,86.36 114.44,91.44 114.92,91.92 CTT-COMANDO.1
FIM-INFERIOR
  Top 0.406: RL_FIM_INFERIOR.11 R6.2
FIM-SUPERIOR
  Top 0.406: RL_FIM_SUPERIOR.11 R3.2
GND  (via drill 0.6 pad 2.54)
  Top 0.508: 68.84,91.19 68.84,89.89 65.62,86.66 64.81,86.66 61.88,83.74 | 66.38,88.9 65.75,88.9 63.61,91.03 63.61,92.84 63.59,92.86
  Top 0.762: COM1.3 COM1.4
  other vias: 69.15,102.87 69.15,102.87 15.78,79.02
  pour Top (isolate 1.016): -0.01,0 -0.01,180.02 82.54,180.02 82.54,61.59 120,61.59 120,0
  pour Bottom (isolate 1.016): -0.01,0 -0.01,180.02 82.54,180.02 82.54,61.59 120,61.59 120,0
INF
  Top 0.406: R11.2 ULN1.7 | U$1.6 20.62,160.18 18.88,158.43 X1.6
  Bottom 0.406: ULN1.7 45.86,97.79 39.83,103.82 33.16,103.82 32.37,104.62 32.37,106.2 31.58,107 15.86,107 14.59,105.73 12.21,105.73 11.42,106.52 11.42,126.05 18.72,133.35 18.72,158.43 X1.6
N$1
  Bottom 1.676: 90,169.7 100.95,169.7 arc-90 101.42,169.23
  Bottom 2.032: SAIDA_CAN.2 112.06,166.05 D15.C 103.65,167.01 101.42,169.23 100.95,169.7 | 90,169.7 D4.C
N$2
  Bottom 2.032: D4.A D5.C 92.36,150.51 F1_CANCELAS.2
N$3
  Bottom 2.032: TRAFO_CAN.2 112.06,155.73 108.41,155.73 D15.A D6.C
N$4
  Bottom 2.032: SAIDA_CAN.1 112.06,161.13 102.7,161.13 D6.A D5.A
N$5
  Bottom 0.762: 89.84,106.52 CTT-DESCE.1 | CTT-SOBE.1 89.84,123.83 85.08,119.06 85.05,114.5 83.68,113.15 83.65,108.6 89.68,106.84 CTT-DESCE.1 | 84.16,82.1 84.16,84.72 89.84,88.9 CTT-FREIO.1 90.16,89.22 92.22,91.28 92.24,104.06 90.1,106.33 90.16,106.2 CTT-DESCE.1 | 84.16,82.1 84.16,71.56 89.84,71.6 CTT-LIGA.1 | PORTA_CABINE.4 74.6,93.03 74.76,93.03 76.55,91.64 76.93,89.77 84.17,83.98 84.16,82.1
N$6
  Top 0.406: RELE_IN_AUDIO1.8 19.35,54.61 24.43,54.61 29.51,49.53 37.45,49.53 38.72,48.26 VOLUME.3
N$7
  Bottom 0.762: D11.C D12.C 92.7,47.63 VREG1.1 90.63,47.31 78.57,35.24 C8.+
N$10
  Top 0.406: R10.1 39.36,84.77 FIM_SUPER..K
N$11
  Top 0.406: 44.83,49.93 47.61,52.71 47.61,58.42 VOLUME1.2 | 44.83,49.93 R26.2 | 44.83,49.93 36.34,58.42 VOLUME.2
N$13
  Bottom 2.032: 112.06,84.46 112.38,84.46 114.29,86.36
N$15
  Bottom 2.032: 114.29,86.04 115.24,86.04 116.83,84.46
N$16
  Bottom 2.032: 110.48,141.29 110.48,141.61 112.38,143.51
N$17
  Bottom 2.032: 110.16,146.05 112.38,143.83
N$18
  Bottom 2.032: 93.97,141.29 93.97,141.92 92.38,143.51 93.97,145.1 93.97,146.05
N$19
  Top 0.406: FIM_INFER..K R11.1
N$20
  Bottom 2.032: 116.51,57.47 116.51,57.15 114.6,55.25
N$21
  Top 0.406: T1.1 R1.1
N$22
  Bottom 2.032: 116.19,57.47 116.19,58.42 114.6,60.01
N$23
  Bottom 2.032: 96.51,57.79 96.51,56.83 98.41,54.93
N$24
  Top 0.406: PORTA_CABIN..K R12.1
N$25
  Bottom 2.032: 98.09,59.69 98.09,59.37 96.19,57.47
N$26
  Bottom 2.032: 114.6,28.26 116.51,30.16 116.51,30.8 114.29,33.02 114.29,33.34
N$27  (via drill 3.5 pad 6.45)
  other vias: 31.73,5.72
N$28
  Top 0.406: R13.1 32.37,118.11 SOBE.K
N$29
  Top 0.406: R14.1 36.18,121.29 DESCE.K
N$30  (via drill 3.5 pad 6.45)
  other vias: 63.48,5.72
N$31  (via drill 3.5 pad 6.45)
  other vias: 88.57,6.99
N$32
  Top 0.406: R15.1 38.72,119.38 FREIO.K
N$33
  Top 0.406: R16.1 44.44,118.11 LIGA.K
N$34  (via drill 3.5 pad 6.45)
  other vias: 88.25,31.43
N$35  (via drill 3.5 pad 7)
  other vias: 6,5
N$36  (via drill 3.5 pad 7)
  other vias: 60.5,174
N$37  (via drill 3.5 pad 7)
  other vias: 79.04,66.36
N$38  (via drill 3.5 pad 7)
  other vias: 115,5
N$39
  Top 0.406: T2.B 63.49,39.05 R50.1
N$40  (via drill 3.5 pad 7)
  other vias: 115,174
N$41  (via drill 3.5 pad 7)
  other vias: 25.6,84.06
N$42  (via drill 3.5 pad 7)
  other vias: 6,174
N$43
  Bottom 0.406: RELE_IN_AUDIO1.6 19.35,59.69 30.15,48.9 30.15,46.36 35.07,41.43 43.32,41.43 50.15,48.26 VOLUME1.3
N$44
  Bottom 0.406: R36.2 35.55,48.58 19.35,64.77 RELE_IN_AUDIO1.4
N$45
  Bottom 2.032: 116.65,68.28 116.09,68.28 114.11,66.29 113.68,66.29 111.92,68.05
N$78
  Bottom 2.032: TRAFO_CAN.1 112.06,143.81 F1_CANCELAS.1
N$79
  Top 0.762: C1.+ R33.1
  Bottom 0.762: IC1.4 29.35,19.37 23.96,24.77 23.96,41.43 | R31.1 23.96,41.43 | R33.1 23.96,41.75 23.96,41.43
N$80
  Top 0.406: C4.- R26.1
N$89
  Top 0.406: R30.2 15.86,27.62 Q1000.C
  Bottom 0.406: C4.+ 40.63,24.13 34.12,17.62 23.48,17.62 19.51,21.59 19.51,25.88 R30.2
N$90
  Top 0.406: R29.2 15.86,30.16 13,33.02 | 13,33.02 R28.1 | 13,33.02 Q1000.B 10.94,33.66 8.88,31.59 8.88,27.94 16.97,19.84 18.56,19.84 19.51,20.8 19.51,21.59 26.02,28.1 C10.+
N$92
  Top 0.406: R27.1 C1002.+ Q1000.E
N$94
  Top 0.406: C3.- R36.1
N$104
  Top 0.762: IC1.5 R30.1 27.93,28.42 | 27.93,28.42 R29.1 | T1.2 61.58,21.27 60.31,21.27 58.41,23.18 C5.1 54.28,23.34 49.2,28.42 27.93,28.42
N$105
  Top 0.406: C3.+ IC1.1
N$106
  Top 0.762: R31.2 R32.1 17.92,42.55 19.67,40.8 19.67,23.5 C2.-
N$119
  Top 0.762: IC1.2 32.21,19.37 30.31,21.27 23.16,21.27 C2.+
N$120
  Top 0.406: R33.2 C102.1
NEG-DESCE
  Top 0.406: CTT-DESCE.2 89.84,118.27 84.28,118.27 D2.C 82.38,116.52 80.63,118.27 73.8,118.27 71.74,116.21 RL_FIM_INFERIOR.4
NEG-FREIO
  Bottom 0.406: CTT-FREIO.2 89.84,100.97 D1.A D2.A 82.51,113.68 84.1,115.27 84.12,117.16 82.54,118.75 D3.A
NEG-LIGA  (via drill 0.51)
  Top 0.406: R16.2 ULN1.14 41.42,105.41 45.55,101.28 v55.23,101.28 | v65.23,91.28 67.45,93.5 84.25,93.5 84.22,83.54 84.91,83.54 89.84,83.5 CTT-LIGA.2
  Bottom 0.406: v65.23,91.28 v55.23,101.28
NEG-SOB
  Bottom 0.406: CTT-SOBE.2 89.84,135.89 D3.C 73.65,135.89 71.42,133.67 RL_FIM_SUPERIOR.4
OPT_AUDIO_FALA
  Top 0.406: ULN1.1 19.99,97.79 14.59,103.19 11.42,103.19 COM1.16
OPT_AUDIO_LIGA
  Bottom 0.406: COM1.14 5.07,101.92 1.89,98.74 1.89,96.84 8.24,90.49 10.62,90.49 11.42,89.69 11.42,74.3 19.04,66.68 22.53,66.68 38.09,51.12 50.94,51.12 62.22,39.85 62.22,27.62 R50.2
OPT_DESCE
  Top 0.406: ULN1.3 33.8,95.41 14.75,95.41 14.59,95.57 11.42,95.57 COM1.10
OPT_FIM_INFERIOR  (via drill 0.51)
  Top 0.406: v29.99,100.65 30.47,100.17 v57.93,100.17
  Bottom 0.406: COM1.7 12.69,95.09 11.42,96.36 11.42,99.85 12.21,100.65 v29.99,100.65 | v57.93,100.17 58.56,100.17 R6.1
OPT_FIM_SUPERIOR  (via drill 0.51)
  Top 0.406: v16.02,98.27 16.02,99.22 14.59,100.65 8.24,100.65 7.45,101.44 7.45,110.01 28.56,131.13 v52.85,131.13
  Bottom 0.406: COM1.9 14.59,96.84 v16.02,98.27 | v52.85,131.13 60.79,123.19 R3.1
OPT_FREIO
  Top 0.406: ULN1.4 33.96,93.03 11.42,93.03 COM1.8
OPT_LIGA
  Top 0.406: ULN1.5 33.96,90.49 11.42,90.49 COM1.6
OPT_PANTOGRAFICA  (via drill 0.51)
  Top 0.406: v29.04,99.38 55.55,99.38 v59.83,95.09
  Bottom 0.406: v29.04,99.38 COM1.11 | v59.83,95.09 63.8,91.12 R23.1
OPT_SENSOR1  (via drill 0.51)
  Top 0.406: v3,98.27 2.68,98.58 2.68,136.68 v7.13,141.13
  Bottom 0.406: COM1.5 11.89,91.76 10.62,93.03 8.24,93.03 v3,98.27 | v7.13,141.13 6.81,141.45 6.81,161.29 18.24,172.72 27.93,172.72 42.21,158.43 42.21,157.32 56.98,142.56 R9.1
OPT_SENSOR2  (via drill 0.51)
  Top 0.406: v3.8,107.63 3.48,107.95 3.48,135.89 v6.02,138.43
  Bottom 0.406: COM1.13 11.89,101.92 10.62,103.19 8.24,103.19 v3.8,107.63 | v6.02,138.43 6.02,161.45 18.08,173.51 34.75,173.51 65.71,142.56 R24.1
OPT_SENSOR3  (via drill 0.51)
  Top 0.406: COM1.15 13.16,103.98 17.92,103.98 19.19,102.71 38.09,102.71 39.99,104.62 39.99,108.9 40.78,109.7 51.74,109.7 v53.96,107.47 | v57.77,107.47 57.77,108.11 71.9,122.24 71.9,129.06 78.09,135.26 R25.1
  Bottom 0.406: v57.77,107.47 v53.96,107.47
OPT_SOBE
  Top 0.406: ULN1.2 32.05,96.2 16.5,96.2 14.59,98.11 11.42,98.11 COM1.12
PANTOGRAFICA
  Top 0.406: PORTA_CABINE.11 R23.2
PORTA_CABINE
  Top 0.406: ULN1.8 48.88,95.25 R12.2 48.88,95.09 41.9,88.11 17.29,88.11 14.27,85.09 8.56,85.09 5.86,87.79 5.86,136.68 10.46,141.29 PORTA.1
RELE_FALAR
  Bottom 0.406: ULN1.18 31.1,99.85 19.35,88.11 19.35,72.55 RELE_IN_AUDIO1.1 19.19,72.71 RELE_IN_AUDIO.1
RELE_LIGA_AUDIO
  Top 0.406: R1.2 T2.C
RL_INF
  Bottom 0.406: ULN1.12 49.52,108.59 RL_FIM_INFERIOR.16
RL_PT_CABINE
  Bottom 0.406: ULN1.11 48.88,103.51 PORTA_CABINE.16
RL_SUP  (via drill 0.51)
  Top 0.406: RL_FIM_SUPERIOR.16 v57.61,122.4
  Bottom 0.406: ULN1.13 43.8,108.59 v57.61,122.4
RS485-A
  Top 0.406: U$1.2 29.51,167.64 38.72,158.43 X1.2
  Bottom 0.406: COM1.17 13.32,107 25.86,119.54 25.86,153.67 20.46,159.07 20.46,159.54 19.35,160.66 18.24,160.66 15.54,157.96 15.54,151.13 8.24,143.83 8.24,139.07 6.49,137.32 5.54,137.32 4.91,137.95 4.91,161.29 22.53,178.91 35.07,178.91 56.18,157.8 56.18,156.53 69.2,143.51 69.2,141.61 68.41,140.81 56.5,140.81 38.88,158.43 X1.2
RS485-B  (via drill 0.51)
  Top 0.406: 42.77,157.4 43.8,158.43 X1.1 | 42.77,157.4 v24.75,139.38 | U$1.1 29.99,170.18 42.77,157.4
  Bottom 0.406: COM1.19 25.07,121.92 25.07,139.07 v24.75,139.38
SAIDA-AUDIO
  Top 0.762: 8.88,53.66 8.88,53.98 RELE_IN_AUDIO.9 | 8.88,53.66 C1.- | RELE_IN_AUDIO.6 9.19,53.66 8.88,53.66
SAIDA_FUSIVEL
  Top 0.762: V1000.2 110.16,36.83 D11.A 107.14,40.01 104.92,42.23 104.92,48.58 106.67,50.32 D14.C 100,57.47 96.51,57.47 FUSIVEL_GERAL.2
SAIDA_FUSIVEL1
  Bottom 0.762: V101.2 107.62,16.83 D8.A D9.C 106.98,20.48 105.4,22.07 105.4,23.97 98.57,30.8 96.51,30.8 FUSIVEL_GERAL1.2
SENSOR1
  Top 0.406: R9.2 57.77,158.43 S2.1
SENSOR2
  Top 0.406: R24.2 67.93,158.43 S3.1
SENSOR3
  Top 0.406: R25.2 78.09,158.43 S4.1
SOB-DESC-PROT
  Bottom 2.184: CTT-DESCE.P 90.13,112.4 94.88,117.14 94.88,125.25 90.23,129.9 87.97,129.9 CTT-SOBE.P
SUP
  Top 0.406: ULN1.6 R10.2 39.36,94.93 33.32,88.9 15.54,88.9 14.59,87.95 8.24,87.95 6.65,89.54 6.65,121.29 23.64,138.27 23.64,148.27 33.8,158.43 X1.3
  Bottom 0.406: U$1.3 25.86,171.61 28.08,171.61 33.8,165.89 33.8,158.43 X1.3
(copper drawn outside any net)
  shapes: Top area x4

### Text on the board
Top: ALEX HENRIQUE / 24/02/2015 | TOP
Bottom: ALEX HENRIQUE / 24/02/2015 | SOLDA
tPlace: JUMPER EM CASO DE NÃO USO | COMUM | COMUM | SENSOR1 | COMUM | SENSOR2 | COMUM | SENSOR3 | AUDIO_TORRE | A | B | GND | +12V | INF-FIM | SUP-FIM | ACESSO REPRESENTA / ACIONADO | ACESSO REPRESENTA / FECHADO